# Altium schematic sheet BMS.SchDoc
size A4; SheetNumber: 9; SheetTotal: 14
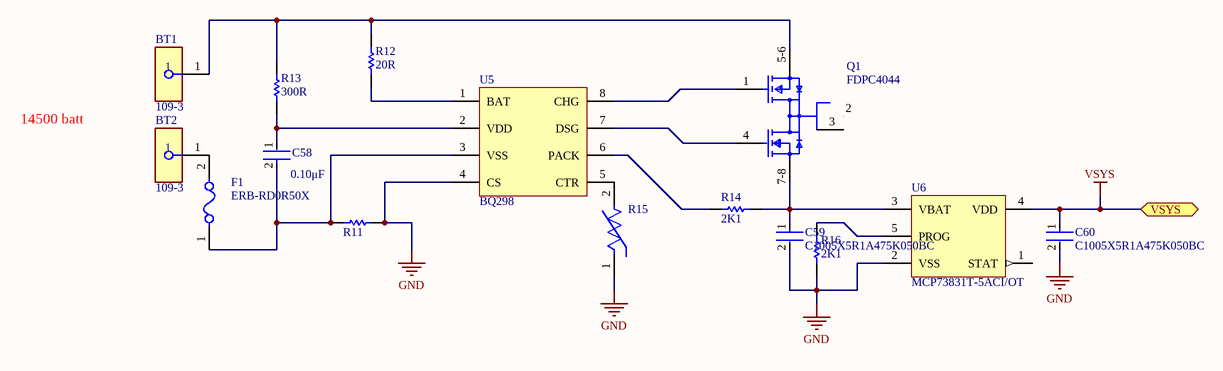
[diagram p0: BMS.SchDoc]

## Parts
BT1  109-3  [FP-109-3-MFG]
BT2  109-3  [FP-109-3-MFG]
C58  Capacitance: 0.10μF  [FP-GRM15-MFG]  (hidden comment: GRM155R71C104KA88D)
C59  C1005X5R1A475K050BC  [FP-C1005-050-0_15-MFG]
C60  C1005X5R1A475K050BC  [FP-C1005-050-0_15-MFG]
F1  ERB-RD0R50X  [FP-ERBRD-MFG]
Q1  FDPC4044  [FP-483BP-MFG]
R11  ERJ-2BSFR10X  [RESC1005X40X27LL10T10]  (value not drawn)
R12  20R  [RESC1005X40X25LL05T10]
R13  300R  [RESC1005X35X20ML05T10]
R14  2K1  [RESC1005X40X25NL05T05]
R15  NCP15XH103F03RC  [FP-NCP15-NCU15-0_05-IPC_C]  (value not drawn)
R16  2K1  [RESC1005X40X25NL05T05]
U5  BQ298  [thingio]
U6  MCP73831T-5ACI/OT  [SOT-23-OT5_N]

## Ports
VSYS (bidir, see PowerSubsystem[2B], DCDC_Converter[2B])

## Nets
GND: C59.2 C60.2 R11.1 R15.1 R16.1 U5.4(CS) U6.2(VSS)
VSYS: C60.1 U6.4(VDD) ; port VSYS
NetBT1_1: BT1.1 Q1.5-6(S1) R12.2 R13.2
NetBT2_1: BT2.1 F1.2
NetC58_1: C58.1 R13.1 U5.2(VDD)
NetC58_2: C58.2 F1.1 R11.2 U5.3(VSS)
NetC59_1: C59.1 Q1.7-8(S2) R14.2 U6.3(VBAT)
NetQ1_1: Q1.1(G1) U5.8(CHG)
NetQ1_4: Q1.4(G2) U5.7(DSG)
NetR12_1: R12.1 U5.1(BAT)
NetR14_1: R14.1 U5.6(PACK)
NetR15_2: R15.2 U5.5(CTR)
NetR16_2: R16.2 U6.5(PROG)

Not connected (* = marked no-connect by the designer): Q1 2(D1) 3(D2); U6 1(STAT)

## Notes on the sheet
- 14500 batt

## Library data of the parts
BT1 BT2 = CMP-19636-000033-1: BATT CONTACT SPRING MULTI PC PIN; Number of Batteries: 2; Lead Free: Lead Free; Color: Black; Package Quantity: 100; Reach SVHC Compliant: Yes; Max Operating Temperature: 145°C; RoHS Compliant: Yes; Mount: Surface Mount; Termination: SMD/SMT; Min Operating Temperature: -50°C; Case/Package: SMD/SMT; Series: -
C58 = CMP-2100-03641-2: CAP CER 0.1UF 16V X7R 0402; Manufacturer: Murata; Standoff Height: 0mm; Tolerance: 10%; Voltage Rating: 16Vdc; Material: Ceramic; Value: 0.10μF; RoHS: TRUE; Manufacturer Part Number: GRM155R71C104KA88D; Temperature Characteristic: X7R; Octopart: https://octopart.com/grm155r71c104ka88d-murata-196880; Digikey Description: CAP CER 0.1UF 16V X7R 0402; Device Class L3: Ceramic Capacitors; Height: 0.55mm; ComponentLink2Description: Datasheet; Temperature Range Low: -55°C; Ipc Land Pattern Name: CAPC10050X219; ComponentLink2URL: https://search.murata.co.jp/Ceramy/image/img/A01X/G101/ENG/GRM155R71H471KA01-01A.pdf; Device Class L1: Passive Components; Lead Free: yes; Category: Cap; Package: GRM15; Temperature: -55°C to +125°C; Device Class L2: Capacitors; Temperature Range High: +125°C; Mouser Description: 0402 0.1 uF 16V ±10 % Tolerance X7R SMT Multilayer Ceramic Capacitor
C59 C60 = CMP-2000-05997-2: CAP CER 4.7UF 10V X5R 0402; Dielectric Material: Ceramic; Tolerance: 10%; Series: C; Package Quantity: 10000; Max Operating Temperature: 85°C; Case Code (Imperial): 0402; Lead Free: Lead Free; Voltage Rating (DC): 10V; Packaging: Cut Tape; Voltage Rating: 10V; Min Operating Temperature: -55°C; Dielectric: X5R; Thickness: 0.022inch; Width: 0.02inch; Case/Package: 0402; Case Code (Metric): 1005; Capacitance: 4.7uF; Length: 0.039inch; RoHS Compliant: Yes; REACH SVHC: No SVHC; Mount: Surface Mount
F1 = CMP-05590-000002-1: FUSE BOARD MNT 500MA 32VDC 0402; Manufacturer: Panasonic Electronic Components; Fuse Current: 0.5A; Fuse Blow Speed: Fast; Voltage Rating: 32V; Value: 310mΩ; Fuse Interrupt Dc Current: 35A; Description: 500mA AC 32V DC Fuse Board Mount (Cartridge Style Excluded) Surface Mount 0402 (1005 Metric); RoHS: TRUE; ComponentLink2Description: Datasheet; Temperature Range High: +125°C; Temperature: -40°C to +125°C; Mouser Description: Fuse Chip Fast Acting 0.5A 32V SMD Solder Pad 0402 1 X 0.5 X 0.39mm T/R UL/cUL; Digikey Description: FUSE BOARD MNT 500MA 32VDC 0402; Device Class L2: Fuses; Temperature Range Low: -40°C; Ipc Land Pattern Name: CAPC10050X39; Octopart: https://octopart.com/erb-rd0r50x-panasonic-21220527; Category: Fuse; Automotive: No; Device Class L3: unset; Lead Free: Yes; Package: ERBRD; Max Fuse Dc Voltage: 32V; Device Class L1: Circuit Protection; Manufacturer Part Number: ERB-RD0R50X; ComponentLink2URL: https://industrial.panasonic.com/cdbs/www-data/pdf/AFA0000/AFA0000C7.pdf; Height: 0.49mm; Resistance: 310mΩ
Q1 = CMP-07173-000013-1: MOSFET 2N-CH 8MLP; Manufacturer: ON Semiconductor; Max Forward Diode Voltage: 1.2V; Transconductance: 150S; Power Dissipation: 1W; Typ Forward Diode Voltage: 0.8V; Depletion Mode: False; Drain To Source Resistance: 3.2mΩ; Drain To Source Breakdown Voltage: 30V; Number Of N Channels: 2; Turn Off Delay Time: 32ns; Continuous Drain Current: 27A; Threshold Vgs Max: 3V; Turn On Delay Time: 8.5ns; Gate To Source Voltage: 20V; Max Junction Temp: +150°C; Standoff Height: 0mm; Rthja Max: 127°C/W; Gate Charge At Vgs: 35nC @ 10V; Mouser Description: MOSFET Common Drain N-Chan Power Trench MOSFET; Package: 483BP; Octopart: https://octopart.com/fdpc4044-on+semiconductor-84326487; Footprint Url: https://www.onsemi.com/pub/Collateral/483BP.PDF; Device Class L2: Transistors; Temperature Range Low: -55°C; Device Class L1: Discrete Semiconductors; Number Of Channels: 2; Temperature: -55°C to +150°C; Category: Trans; Manufacturer Part Number: FDPC4044; RoHS: TRUE; Device Class L3: MOSFETs; Height: 0.8mm; Temperature Range High: +150°C; Lead Free: Yes; ComponentLink2URL: https://www.onsemi.com/pub/Collateral/FDPC4044-D.PDF; Automotive: No; Threshold Vgs Min: 1.2V; ComponentLink2Description: Datasheet; Digikey Description: MOSFET 2N-CH 8MLP
R11 = CMP-2002-04635-1: Manufacturer: Panasonic; Part Number: ERJ-2BSFR10X
R12 = CMP-2002-07502-1: Part Number: RC0402FR-0720RL; Manufacturer: Yageo / Phycomp
R13 = CMP-2002-03249-1: Part Number: CPF0402B300RE1; Manufacturer: TE Connectivity / AMP
R14 R16 = CMP-2002-08450-1: Part Number: CRCW04022K10FKED; Manufacturer: Vishay Dale
R15 = CMP-06022-000003-3: NTC Thermistor for Temperature Sensor, 0402, 10kΩ, 1%, 0.1mA, 5V; Max Power Dissipation: 100mW; Resistance: 10kR; Current Rating: 310uA; Length: 1mm; Min Operating Temperature: -40°C; Max Operating Temperature: 125°C; Resistance Tolerance: 1%; Lead Free: Lead Free; Radiation Hardening: No; Case Code (Imperial): 0402; Depth: 0.5mm; Tolerance: 1%; Packaging: Tape and Reel; Package Quantity: 10000; Series: NCP; Number of Pins: 2; Power Rating: 100mW; Case/Package: 0402; Case Code (Metric): 1005; Height: 0.5mm; Termination: SMD/SMT; RoHS Compliant: Yes; REACH SVHC: No SVHC; Mount: Surface Mount
U5 = BQ298: BQ298xyz Voltage, Current, Temperature Protectors with an Integrated High-Side / NFET Driver for Fast/Flash Charging Single-Cell Li-Ion and Li-Polymer Batteries
U6 = CMP-0133-00136-1: Miniature Single-Cell, Fully Integrated Li-Ion, Li-Polymer Charge Management Controller, 4.5V, 5-Pin SOT-23, Industrial Temperature, Tape and Reel; PackageReference: SOT-23-OT5; PackageDescription: 5-Lead Plastic Small Outline Transistor (OT) [SOT-23]; PackageVersion: revBB, Aug-2009; DatasheetVersion: revE, Sep-2008; Code_IPC: SOT23-5